# EAGLE design eLite Clock - Main - v2 (EAGLE 9.6.0)
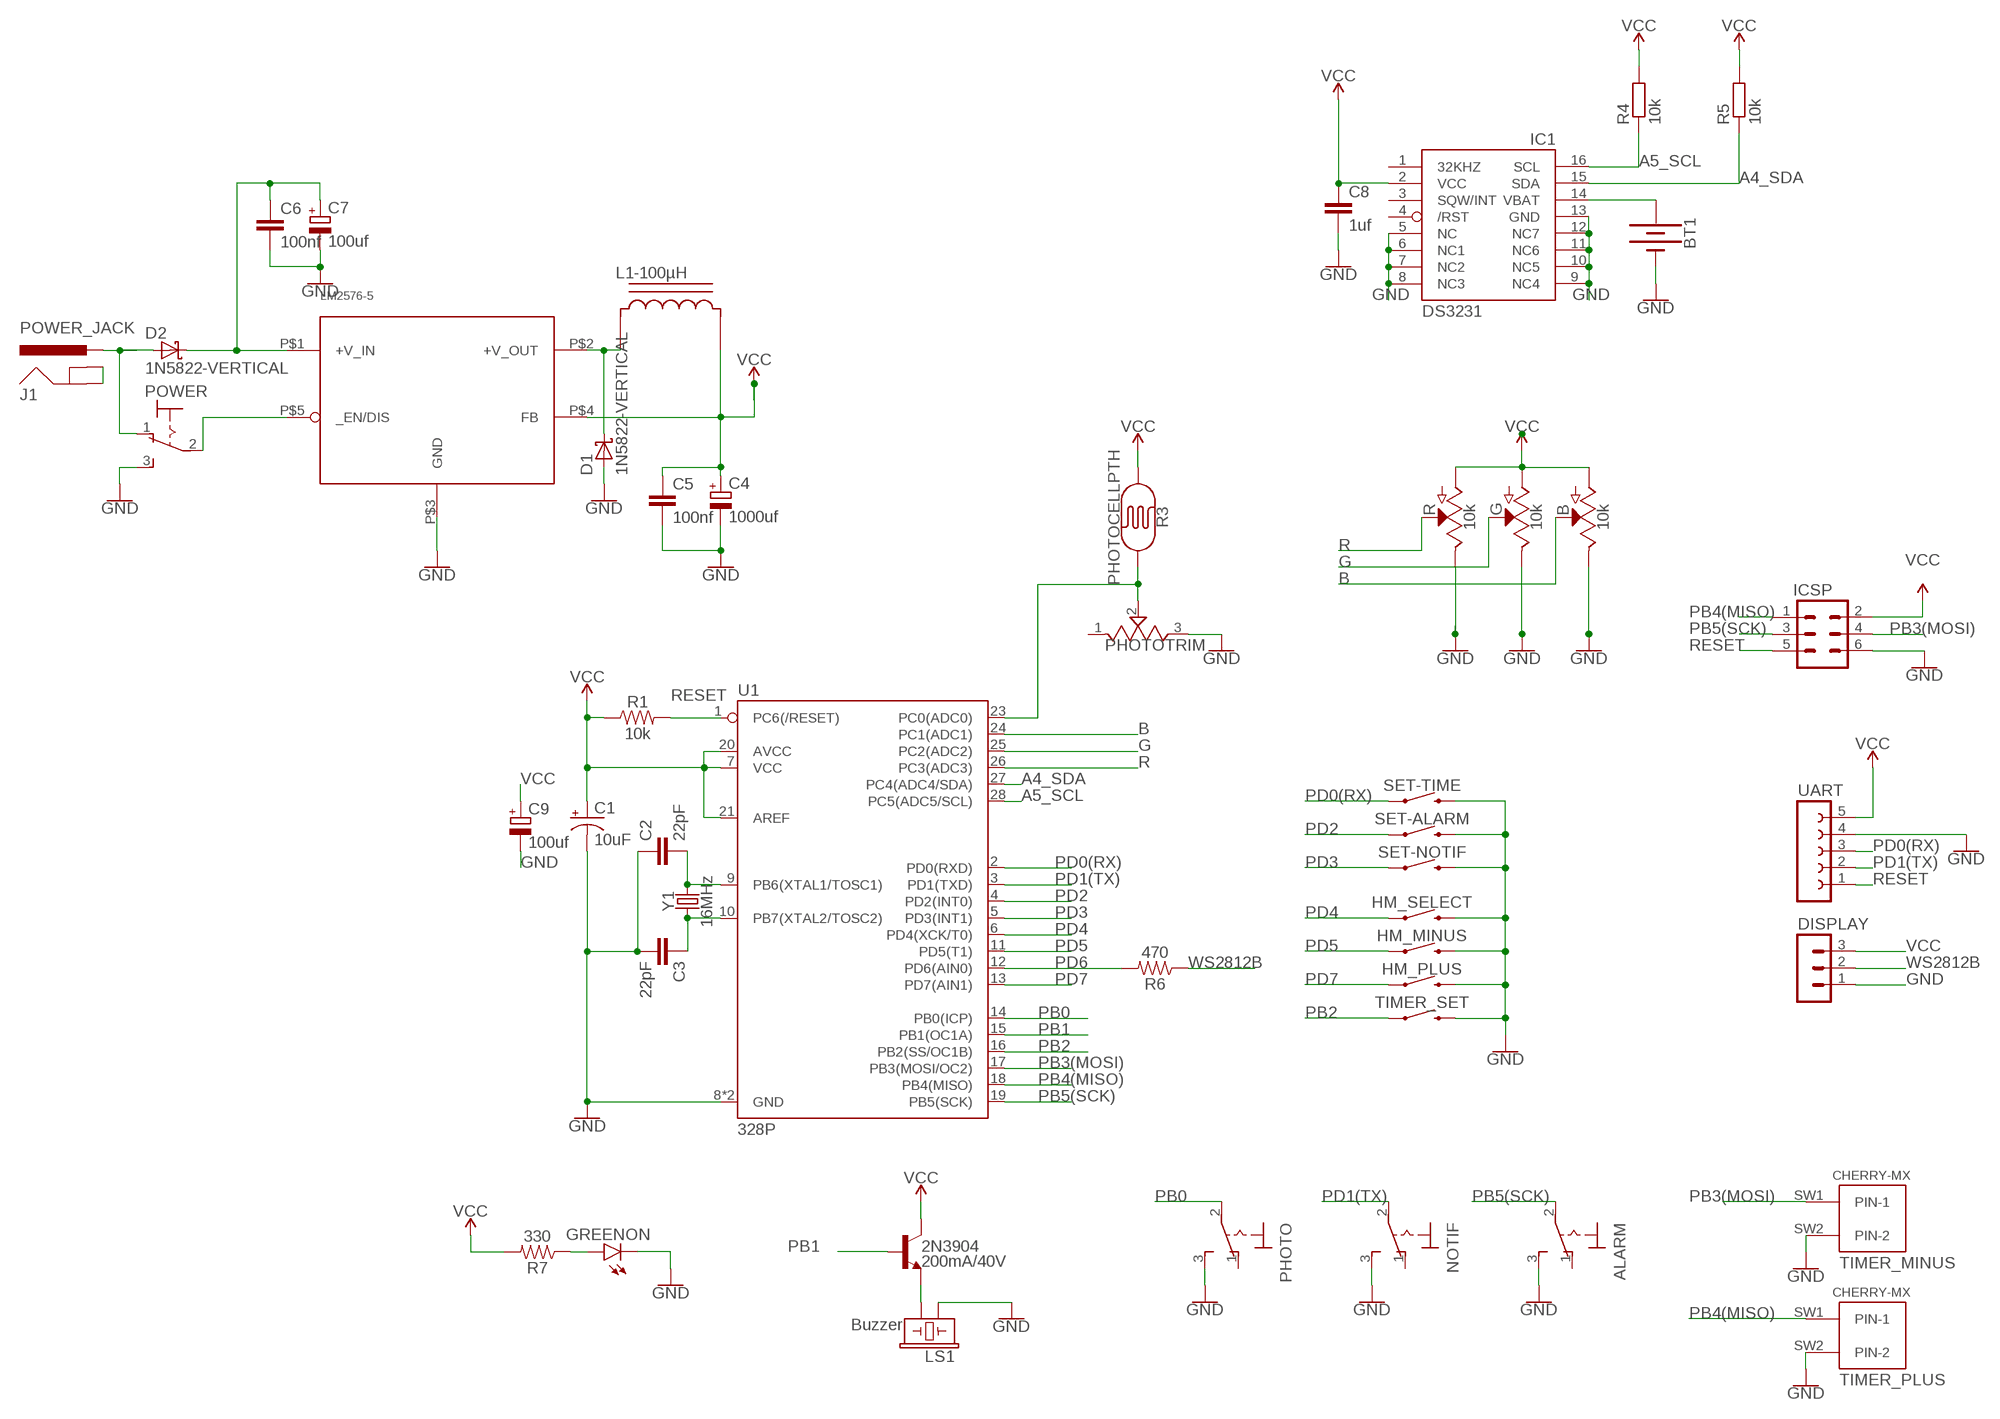
[diagram p0: schematic, sheet 1]

## Parts
2N3904  200mA/40V  TRANS_NPN-2N3904  [TO-92]
ALARM  320-916  [320-916]
B  10k  POT  [SINGLE_GANK_POTENTIOMETER]
BT1  BATTERY-20MM_PTH  [BATTCOM_20MM_PTH]
C1  10uF  10UF-POLAR-RADIAL-2.5MM-25V-20%  [CPOL-RADIAL-2.5MM-5MM]
C2  22pF  22PF-PTH-2.54MM-200V-5%  [CAP-PTH-2.54]
C3  22pF  22PF-PTH-2.54MM-200V-5%  [CAP-PTH-2.54]
C4  1000uf  CPOL-EUE5-13  [E5-13]
C5  100nf  C-EU025-025X050  [C025-025X050]
C6  100nf  C-EU025-025X050  [C025-025X050]
C7  100uf  CPOL-EUE2.5-5  [E2,5-5]
C8  1uf  C-EU025-025X050  [C025-025X050]
C9  100uf  CPOL-EUE3.5-10  [E3,5-10]
D1  1N5822-VERTICAL  [DIODE-VERTICAL]
D2  1N5822-VERTICAL  [DIODE-VERTICAL]
DISPLAY  MA03-1  [MA03-1]
G  10k  POT  [SINGLE_GANK_POTENTIOMETER]
GREENON  LED5MM  [LED5MM]
HM_MINUS  MOMENTARY-SWITCH-SPST-PTH-6.0MM  [TACTILE_SWITCH_PTH_6.0MM]
HM_PLUS  MOMENTARY-SWITCH-SPST-PTH-6.0MM  [TACTILE_SWITCH_PTH_6.0MM]
HM_SELECT  MOMENTARY-SWITCH-SPST-PTH-6.0MM  [TACTILE_SWITCH_PTH_6.0MM]
IC1  DS3231/SO  [SO16W]
ICSP  MA03-2  [MA03-2]
J1  POWER_JACK  [POWER_JACK_PTH]
L1-100µH  T37_INDUCTOR  [T37_INDUCTOR]
LM2576-5  LM2576-T05A  [TO-220-5_IN-LINE]
LS1  Buzzer  BUZZER-PTH  [BUZZER-12MM]
NOTIF  320-916  [320-916]
PHOTO  320-916  [320-916]
PHOTOTRIM  3306F-1-203  [TRIM_3306F-1-203]
POWER  320-916  [320-916]
R  10k  POT  [SINGLE_GANK_POTENTIOMETER]
R1  10k  10KOHM-HORIZ-1/4W-1%  [AXIAL-0.3]
R3  PHOTOCELLPTH  [PHOTOCELL]
R4  10k  R-EU_0207/7  [0207/7]
R5  10k  R-EU_0207/7  [0207/7]
R6  470  10KOHM-HORIZ-1/4W-1%  [AXIAL-0.3]
R7  330  10KOHM-HORIZ-1/4W-1%  [AXIAL-0.3]
SET-ALARM  MOMENTARY-SWITCH-SPST-PTH-6.0MM  [TACTILE_SWITCH_PTH_6.0MM]
SET-NOTIF  MOMENTARY-SWITCH-SPST-PTH-6.0MM  [TACTILE_SWITCH_PTH_6.0MM]
SET-TIME  MOMENTARY-SWITCH-SPST-PTH-6.0MM  [TACTILE_SWITCH_PTH_6.0MM]
TIMER_MINUS  TIMER_PLUS  CHERRY-MX  [CHERRY-MX]
TIMER_PLUS  TIMER_MINUS  CHERRY-MX  [CHERRY-MX]
TIMER_SET  MOMENTARY-SWITCH-SPST-PTH-6.0MM  [TACTILE_SWITCH_PTH_6.0MM]
U1  328P  ATMEGA328P_PDIP  [DIP28]
UART  FE05-1  [FE05-1]
Y1  16MHz  CRYSTAL-16MHZPTH-HC49US  [HC49US]

## Nets
A4_SDA: IC1.15(SDA) R5.1 U1.27(PC4(ADC4/SDA))
A5_SCL: IC1.16(SCL) R4.1 U1.28(PC5(ADC5/SCL))
B: B.P$2 U1.24(PC1(ADC1))
G: G.P$2 U1.25(PC2(ADC2))
GND: ALARM.3(S) B.P$1 BT1.2(-) C1.2(-) C2.1 C3.2 C4.- C5.2 C6.2 C7.- C8.2 C9.- D1.ANODE(A) DISPLAY.1 G.P$1 GREENON.K(C) HM_MINUS.3 HM_PLUS.3 HM_SELECT.3 IC1.5(NC) IC1.6(NC1) IC1.7(NC2) IC1.8(NC3) IC1.9(NC4) IC1.10(NC5) IC1.11(NC6) IC1.12(NC7) IC1.13(GND) ICSP.6 LM2576-5.P$3(GND) LS1.+ NOTIF.3(S) PHOTO.3(S) PHOTOTRIM.3(CW) POWER.3(S) R.P$1 SET-ALARM.3 SET-NOTIF.3 SET-TIME.3 TIMER_MINUS.SW2(PIN-2) TIMER_PLUS.SW2(PIN-2) TIMER_SET.3 U1.8(GND) U1.22(GND) UART.4
N$1: J1.GND J1.GNDBREAK
N$2: C2.2 U1.9(PB6(XTAL1/TOSC1)) Y1.2
N$3: C3.1 U1.10(PB7(XTAL2/TOSC2)) Y1.1
N$4: GREENON.A R7.P$1
N$5: PHOTOTRIM.2(W) R3.2 U1.23(PC0(ADC0))
N$6: D2.ANODE(A) J1.PWR POWER.1(O)
N$7: LM2576-5.P$5(_EN/DIS) POWER.2(P)
N$14: 2N3904.1(E) LS1.-
N$18: D1.CATHODE(C) L1-100µH.CB LM2576-5.P$2(+V_OUT)
N$24: C6.1 C7.+ D2.CATHODE(C) LM2576-5.P$1(+V_IN)
N$26: BT1.1(+) IC1.14(VBAT)
PB0: PHOTO.2(P) U1.14(PB0(ICP))
PB1: 2N3904.2(B) U1.15(PB1(OC1A))
PB2: TIMER_SET.1 U1.16(PB2(SS/OC1B))
PB3(MOSI): ICSP.4 TIMER_MINUS.SW1(PIN-1) U1.17(PB3(MOSI/OC2))
PB4(MISO): ICSP.1 TIMER_PLUS.SW1(PIN-1) U1.18(PB4(MISO))
PB5(SCK): ALARM.2(P) ICSP.3 U1.19(PB5(SCK))
PD0(RX): SET-TIME.1 U1.2(PD0(RXD)) UART.3
PD1(TX): NOTIF.2(P) U1.3(PD1(TXD)) UART.2
PD2: SET-ALARM.1 U1.4(PD2(INT0))
PD3: SET-NOTIF.1 U1.5(PD3(INT1))
PD4: HM_SELECT.1 U1.6(PD4(XCK/T0))
PD5: HM_MINUS.1 U1.11(PD5(T1))
PD6: R6.P$2 U1.12(PD6(AIN0))
PD7: HM_PLUS.1 U1.13(PD7(AIN1))
R: R.P$2 U1.26(PC3(ADC3))
RESET: ICSP.5 R1.P$2 U1.1(PC6(/RESET)) UART.1
VCC: 2N3904.3(C) B.P$3 C1.1(+) C4.+ C5.1 C8.1 C9.+ DISPLAY.3 G.P$3 IC1.2(VCC) ICSP.2 L1-100µH.CA LM2576-5.P$4(FB) R1.P$1 R3.1 R4.2 R5.2 R7.P$2 R.P$3 U1.7(VCC) U1.20(AVCC) U1.21(AREF) UART.5
WS2812B: DISPLAY.2 R6.P$1
Unconnected: ALARM.1(O) IC1.1(32KHZ) IC1.3(SQW/INT) IC1.4(/RST) NOTIF.1(O) PHOTO.1(O) PHOTOTRIM.1(CCW)

## Library data of the parts
2N3904 = SparkFun-DiscreteSemi:TRANS_NPN: NPN transistor Current controlled devices typically used to amplify current or used as a switch. BC547 - COM-08928 <http://www.sparkfun.com/products/8928> (TO-92 45V 100mA) (1.Collector 2.Base 3.Emitter) 2N3904 - COM-00521 <http://www.sparkfun.com/products/521> (TO-92 40V 200mA) (1.Emitter 2.Base 3.Collector) P2N2222A - COM-12852 <http://www.sparkfun.com/products/12852> (TO-92 40V 600mA) (1.Collector 2.Base 3.Emitter); PROD_ID: TRANS-08447
ALARM NOTIF PHOTO POWER = switch:320-916: TOGGLE SWITCH distributor RS Components
B G R = SingleGankPotentiometer:POT
BT1 = SparkFun-Batteries:BATTERY: Battery - Single Cell A variety of battery chemistries, sizes, and footprints. Device List: 20MM_PTH - Coin Cell Battery Holder - 20mm (PTH) <https://www.sparkfun.com/products/783> 20MM_PTH_KIT- Coin Cell battery Holder - 20 mm (PTH) <http://www.sparkfun.com/products/783>kit version with special mask 6.8MM_PTH - Coin Cell Battery Holder - 6.8MM(SMD) <https://www.digikey.com/product-detail/en/seiko-instruments/MS621FE-FL11E/728-1057-ND/1889208?WT.srch=1&gclid=CNOQ5a6LzdQCFZS2wAodXCkE0g> 12MM_SMD - Coin Cell Battery Holder - 12mm (SMD) <https://www.sparkfun.com/products/10592> 12MM_PTH - Coin Cell Battery Holder - 12mm (PTH) <https://www.sparkfun.com/products/7948> 20MM_SMD - 20mm Coin Cell Battery Holder (SMD) (2 legs) Used on the Big Time Watch Kit <https://www.sparkfun.com/products/11734> 20MM_SMD_4LEGS - Coin Cell Battery Holder - 20mm (SMD) <https://www.sparkfun.com/products/11892> 20MM_SMD_4LEGS_OVERPASTE - Coin Cell Battery Holder - 20mm (SMD) <https://www.sparkfun.com/products/11892> (Over-paste on the legs) 24.5MM_PTH - Coin Cell Battery Holder - 24.5mm (PTH) <https://www.sparkfun.com/products/8863> 9V - 9V Battery Holder - PC Mount Used on the SparkFun SparkPunk Sound Kit <https://www.sparkfun.com/products/11177> and SparkFun SparkPunk Sequencer Kit <https://www.sparkfun.com/products/12707> 18650 - Battery Holder - 18650 (PTH) <https://www.sparkfun.com/products/13113> AA - Battery Holder - 1xAA (PTH) <https://www.sparkfun.com/products/7949> AAA - Battery Holder - 1xAAA (PTH) <https://www.sparkfun.com/products/12718> AA_KIT - Battery Holder - 1xAA (PTH) <https://www.sparkfun.com/products/7949> Special kit package - pads only have exposed copper on one side of the board. AAA_KIT - Battery Holder - 1xAAA (PTH) <https://www.sparkfun.com/products/12718> Special kit package - pads only have exposed copper on one side of the board.; PROD_ID: BATT-09031; SF_SKU: PRT-00783
C1 = SparkFun-Capacitors:10UF-POLAR: 10.0µF polarized capacitors A capacitor is a passive two-terminal electrical component used to store electrical energy temporarily in an electric field.; PROD_ID: CAP-08440
C2 C3 = SparkFun-Capacitors:22PF: 22pF ceramic capacitors A capacitor is a passive two-terminal electrical component used to store electrical energy temporarily in an electric field.; PROD_ID: CAP-09128
C4 C7 C9 = rcl:CPOL-EU: POLARIZED CAPACITOR, European symbol; SPICEPREFIX: C
C5 C6 C8 = rcl:C-EU: CAPACITOR, European symbol; SPICEPREFIX: C
D1 D2 = 1N5822:1N5822-VERTICAL
DISPLAY = con-lstb:MA03-1: PIN HEADER; OC_FARNELL: unknown; OC_NEWARK: unknown
GREENON = led:LED: LED OSRAM: - CHIPLED LG R971, LG N971, LY N971, LG Q971, LY Q971, LO R971, LY R971 LH N974, LH R974 LS Q976, LO Q976, LY Q976 LO Q996 - Hyper CHIPLED LW Q18S LB Q993, LB Q99A, LB R99A - SideLED LS A670, LO A670, LY A670, LG A670, LP A670 LB A673, LV A673, LT A673, LW A673 LH A674 LY A675 LS A676, LA A676, LO A676, LY A676, LW A676 LS A679, LY A679, LG A679 - Hyper Micro SIDELED® LS Y876, LA Y876, LO Y876, LY Y876 LT Y87S - SmartLED LW L88C, LW L88S LB L89C, LB L89S, LG L890 LS L89K, LO L89K, LY L89K LS L896, LA L896, LO L896, LY L896 - TOPLED LS T670, LO T670, LY T670, LG T670, LP T670 LSG T670, LSP T670, LSY T670, LOP T670, LYG T670 LG T671, LOG T671, LSG T671 LB T673, LV T673, LT T673, LW T673 LH T674 LS T676, LA T676, LO T676, LY T676, LB T676, LH T676, LSB T676, LW T676 LB T67C, LV T67C, LT T67C, LS T67K, LO T67K, LY T67K, LW E67C LS E67B, LA E67B, LO E67B, LY E67B, LB E67C, LV E67C, LT E67C LW T67C LS T679, LY T679, LG T679 LS T770, LO T770, LY T770, LG T770, LP T770 LB T773, LV T773, LT T773, LW T773 LH T774 LS E675, LA E675, LY E675, LS T675 LS T776, LA T776, LO T776, LY T776, LB T776 LHGB T686 LT T68C, LB T68C - Hyper Mini TOPLED® LB M676 - Mini TOPLED Santana® LG M470 LS M47K, LO M47K, LY M47K Source: http://www.osram.convergy.de LUXEON: - LUMILED® LXK2-PW12-R00, LXK2-PW12-S00, LXK2-PW14-U00, LXK2-PW14-V00 LXK2-PM12-R00, LXK2-PM12-S00, LXK2-PM14-U00 LXK2-PE12-Q00, LXK2-PE12-R00, LXK2-PE12-S00, LXK2-PE14-T00, LXK2-PE14-U00 LXK2-PB12-K00, LXK2-PB12-L00, LXK2-PB12-M00, LXK2-PB14-N00, LXK2-PB14-P00, LXK2-PB14-Q00 LXK2-PR12-L00, LXK2-PR12-M00, LXK2-PR14-Q00, LXK2-PR14-R00 LXK2-PD12-Q00, LXK2-PD12-R00, LXK2-PD12-S00 LXK2-PH12-R00, LXK2-PH12-S00 LXK2-PL12-P00, LXK2-PL12-Q00, LXK2-PL12-R00 Source: www.luxeon.com KINGBRIGHT: KA-3528ASYC Source: www.kingbright.com
HM_MINUS HM_PLUS HM_SELECT SET-ALARM SET-NOTIF SET-TIME TIMER_SET = SparkFun-Switches:MOMENTARY-SWITCH-SPST: Momentary Switch (Pushbutton) - SPST Normally-open (NO) SPST momentary switches (buttons, pushbuttons). Variants PTH-12MM - 12mm square, through-hole Momentary Pushbutton Switch - 12mm Square <https://www.sparkfun.com/products/9190> (COM-09190) PTH-6.0MM, PTH-6.0MM-KIT - 6.0mm square, through-hole Mini Pushbutton Switch <https://www.sparkfun.com/products/97> (COM-00097) KIT package intended for soldering kit's - only one side of pads' copper is exposed. PTH-RIGHT-ANGLE-KIT - Right-angle, through-hole Right Angle Tactile Button <https://www.sparkfun.com/products/10791> - Used on SparkFun BigTime Watch Kit <https://www.sparkfun.com/products/11734> SMD-12MM - 12mm square, surface-mount Tactile Button - SMD (12mm) <https://www.sparkfun.com/products/12993> (COM-12993) Used on SparkFun PicoBoard <https://www.sparkfun.com/products/11888> SMD-4.5MM - 4.5mm Square Trackball Switch Used on SparkFun Blackberry Trackballer Breakout <https://www.sparkfun.com/products/13169> SMD-4.6MMX2.8MM - 4.60mm x 2.80mm, surface mount Used on SparkFun SAMD21 Mini Breakout <https://www.sparkfun.com/products/13664> SMD-5.2MM, SMD-5.2-REDUNDANT - 5.2mm square, surface-mount Mini Pushbutton Switch - SMD <https://www.sparkfun.com/products/8720> (COM-08720) Used on Arduino Pro Mini <https://www.sparkfun.com/products/11114> REDUNDANT package connects both switch circuits together SMD-6.0X3.5MM - 6.0 x 3.5mm, surface mount Momentary Reset Switch SMD <https://www.sparkfun.com/products/8229> (COM-08229) SMD-6.2MM-TALL - 6.2mm square, surface mount Tactile Button - SMD (6mm) <https://www.sparkfun.com/products/12992> Used on SparkFun Digital Sandbox <https://www.sparkfun.com/products/12651> SMD-RIGHT-ANGLE - Right-angle, surface mount Used on SparkFun Block for Intel® Edison - Arduino <https://www.sparkfun.com/products/13036>; PROD_ID: SWCH-08441; SF_SKU: COM-00097
IC1 = adafruit:DS3231
ICSP = con-lstb:MA03-2: PIN HEADER; OC_FARNELL: unknown; OC_NEWARK: unknown
J1 = SparkFun-Connectors:POWER_JACK: Power Jack Connector This is the standard 5.5mm barrel jack for power. The PTH is the most common, proven, reliable, footprint. The Slot footprint only works if the mill layer is transmitted to the PCB fab house so be warned. Here are the connectors we sell at SparkFun: DC Barrel Power Jack/Connector <https://www.sparkfun.com/products/119> (PRT-00119) DC Barrel Power Jack/Connector (SMD) <https://www.sparkfun.com/products/12748> (PRT-12748) DC Barrel Jack Adapter - Breadboard Compatible <https://www.sparkfun.com/products/10811> (PRT-10811) It is used on this SparkFun product (and many, many others): SparkFun RedBoard - Programmed with Arduino <https://www.sparkfun.com/products/12757> (DEV-12757) Also, if you need a mating power supply or connector, please check these out: Wall Adapter Power Supply - 9VDC 650mA <https://www.sparkfun.com/products/298> (TOL-00298) DC Barrel Jack Adapter - Male <https://www.sparkfun.com/products/10287> (PRT-10287); PROD_ID: CONN-08197
L1-100µH = toroid:T37_INDUCTOR: Inductor wound on a T37 Toroid
LM2576-5 = LM2576:LM2576-T05A: LM2576/LM2576HV Series SIMPLE SWITCHER® 3A Step-Down Voltage Regulator IN-LINE PACKAGE; SPICEPREFIX: X
LS1 = SparkFun-Electromechanical:BUZZER: Buzzer Small round buzzers that operate around the audible 2kHz range. You can use these as speakers to create simple music or user interfaces. Variant Overview: PTH - Mini Speaker - PC Mount 12mm 2.048kHz <https://www.sparkfun.com/products/7950> PTH_KIT - Mini Speaker - PC Mount 12mm 2.048kHz <https://www.sparkfun.com/products/7950> KIT simplifies soldering by adding stop mask to one side of the pads. PTH_NO_SILK - Mini Speaker - PC Mount 12mm 2.048kHz <https://www.sparkfun.com/products/7950> No silkscreen indicator of buzzer outline. PTH_KIT_NO_SILK - Mini Speaker - PC Mount 12mm 2.048kHz <https://www.sparkfun.com/products/7950> KIT package w/o silkscreen SMD - Buzzer Audio Magnetic (CCV-084B16) SMD buzzer used on, e.g. the LilyPad Buzzer <https://www.sparkfun.com/products/8463> and RFID USB Reader <https://www.sparkfun.com/products/9963>. SMD_KIT - Buzzer Audio Magnetic (CCV-084B16) SMD Buzzer with elongated pins to make soldering easier. Used on the SparkFun Simon Says - Surface Mount Soldering Kit <https://www.sparkfun.com/products/10935>.; PROD_ID: COMP-08253; SF_SKU: COM-07950
PHOTOTRIM = 3306F-1-203:3306F-1-203: 2 kOhms 0.2W, 1/5W PC Pins Through Hole Trimmer Potentiometer Cermet 1 Turn Top Adjustment; ARROW_ELECTRONICS-PURCHASE-URL: https://snapeda.com/shop?store=Arrow+Electronics&id=1444258; AVAILABILITY: Unavailable; DESCRIPTION: 20 kOhms 0.2W, 1/5W PC Pins Through Hole Trimmer Potentiometer Cermet 1 Turn Top Adjustment; DIGIKEY-PURCHASE-URL: https://snapeda.com/shop?store=DigiKey&id=1444258; MF: Bourns; MOUSER-PURCHASE-URL: https://snapeda.com/shop?store=Mouser&id=1444258; MP: 3306F-1-203; PACKAGE: 6432 Bourns; PRICE: None
R1 = SparkFun-Resistors:10KOHM: 10kΩ resistor A resistor is a passive two-terminal electrical component that implements electrical resistance as a circuit element. Resistors act to reduce current flow, and, at the same time, act to lower voltage levels within circuits. - Wikipedia; PROD_ID: RES-12183
R3 = SparkFun-Sensors:PHOTOCELL: Photocell (Photodetector, Photo Resistor, CdS) This is a very small light sensor. A photocell changes (also called a photodetector, photo resistor, CdS or photoconductive cell) resistance depending on the amount of light it is exposed to. These little sensors make great ambient light triggers (when light in the room turns on, do something). Datasheet <http://cdn.sparkfun.com/datasheets/Sensors/LightImaging/SEN-09088.pdf> SparkFun Products Mini Photocell <https://www.sparkfun.com/products/9088> (SEN-09088); PROD_ID: COMP-09129; SF_ID: SEN-09088
R4 R5 = rcl:R-EU_: RESISTOR, European symbol; SPICEPREFIX: R
R6 R7 = SparkFun-Resistors:10KOHM: 10kΩ resistor A resistor is a passive two-terminal electrical component that implements electrical resistance as a circuit element. Resistors act to reduce current flow, and, at the same time, act to lower voltage levels within circuits. - Wikipedia; PROD_ID: RES-12183; VALUE: 10k
TIMER_MINUS TIMER_PLUS = cherrymx:CHERRY-MX: Cherry MX series keyswitch
U1 = SparkFun-IC-Microcontroller:ATMEGA328P_PDIP: Atmel 328P Through hole ATMEGA328P uC used in the Arduino 32kb flash, 1k EEPROM, 2k SRAM Datasheet <http://www.sparkfun.com/datasheets/Components/SMD/ATMega328.pdf> SparkFun Products Storefront component: AVR 28 Pin 20MHz 32K 6A/D - ATMega328P <https://www.sparkfun.com/products/9061> (COM-09061) SparkFun Simon Says - Through-Hole Soldering Kit <https://www.sparkfun.com/products/10547> (KIT-10547) SparkFun Learn to Solder - Simon Says <https://www.sparkfun.com/products/13708> (KIT-13708) SparkFun BigTime Watch Kit <https://www.sparkfun.com/products/11734> (KIT-11734) SparkFun ClockIt <https://www.sparkfun.com/products/10930> (KIT-10930) SparkFun Serial Enabled LCD Kit <https://www.sparkfun.com/products/10097> (LCD-10097) SparkFun Simon Tilts - Through Hole Soldering Kit <https://www.sparkfun.com/products/12634> (KIT-12634) SparkFun Frequency Counter Kit <https://www.sparkfun.com/products/10140> (KIT-10140) FabFM Radio Kit <https://www.sparkfun.com/products/11043> (KIT-11043) SparkFun Binary Blaster Kit <https://www.sparkfun.com/products/12037> (KIT-12037) SparkFun Metro-Gnome <https://www.sparkfun.com/products/9236> (KIT-09236) ATmega328 with Arduino Optiboot (Uno) <https://www.sparkfun.com/products/10524> (DEV-10524); PROD_ID: IC-09136
UART = con-lsta:FE05-1: FEMALE HEADER; OC_FARNELL: unknown; OC_NEWARK: unknown
Y1 = SparkFun-Clocks:CRYSTAL-16MHZ: 16MHz Crystal Digikey Example <http://www.digikey.com/product-search/en?keywords=535-9122-1-ND> Frequency: 16MHz Frequency Stability: ±50ppm Frequency Tolerance: ±20ppm Load Capacitance: 18pF SparkFun Products: Pro Micro -5V/16MHz <https://www.sparkfun.com/products/12640> SparkFun Serial Enabled LCD Kit <https://www.sparkfun.com/products/10097>; PROD_ID: XTAL-08181; SF_ID: COM-00536

## Board
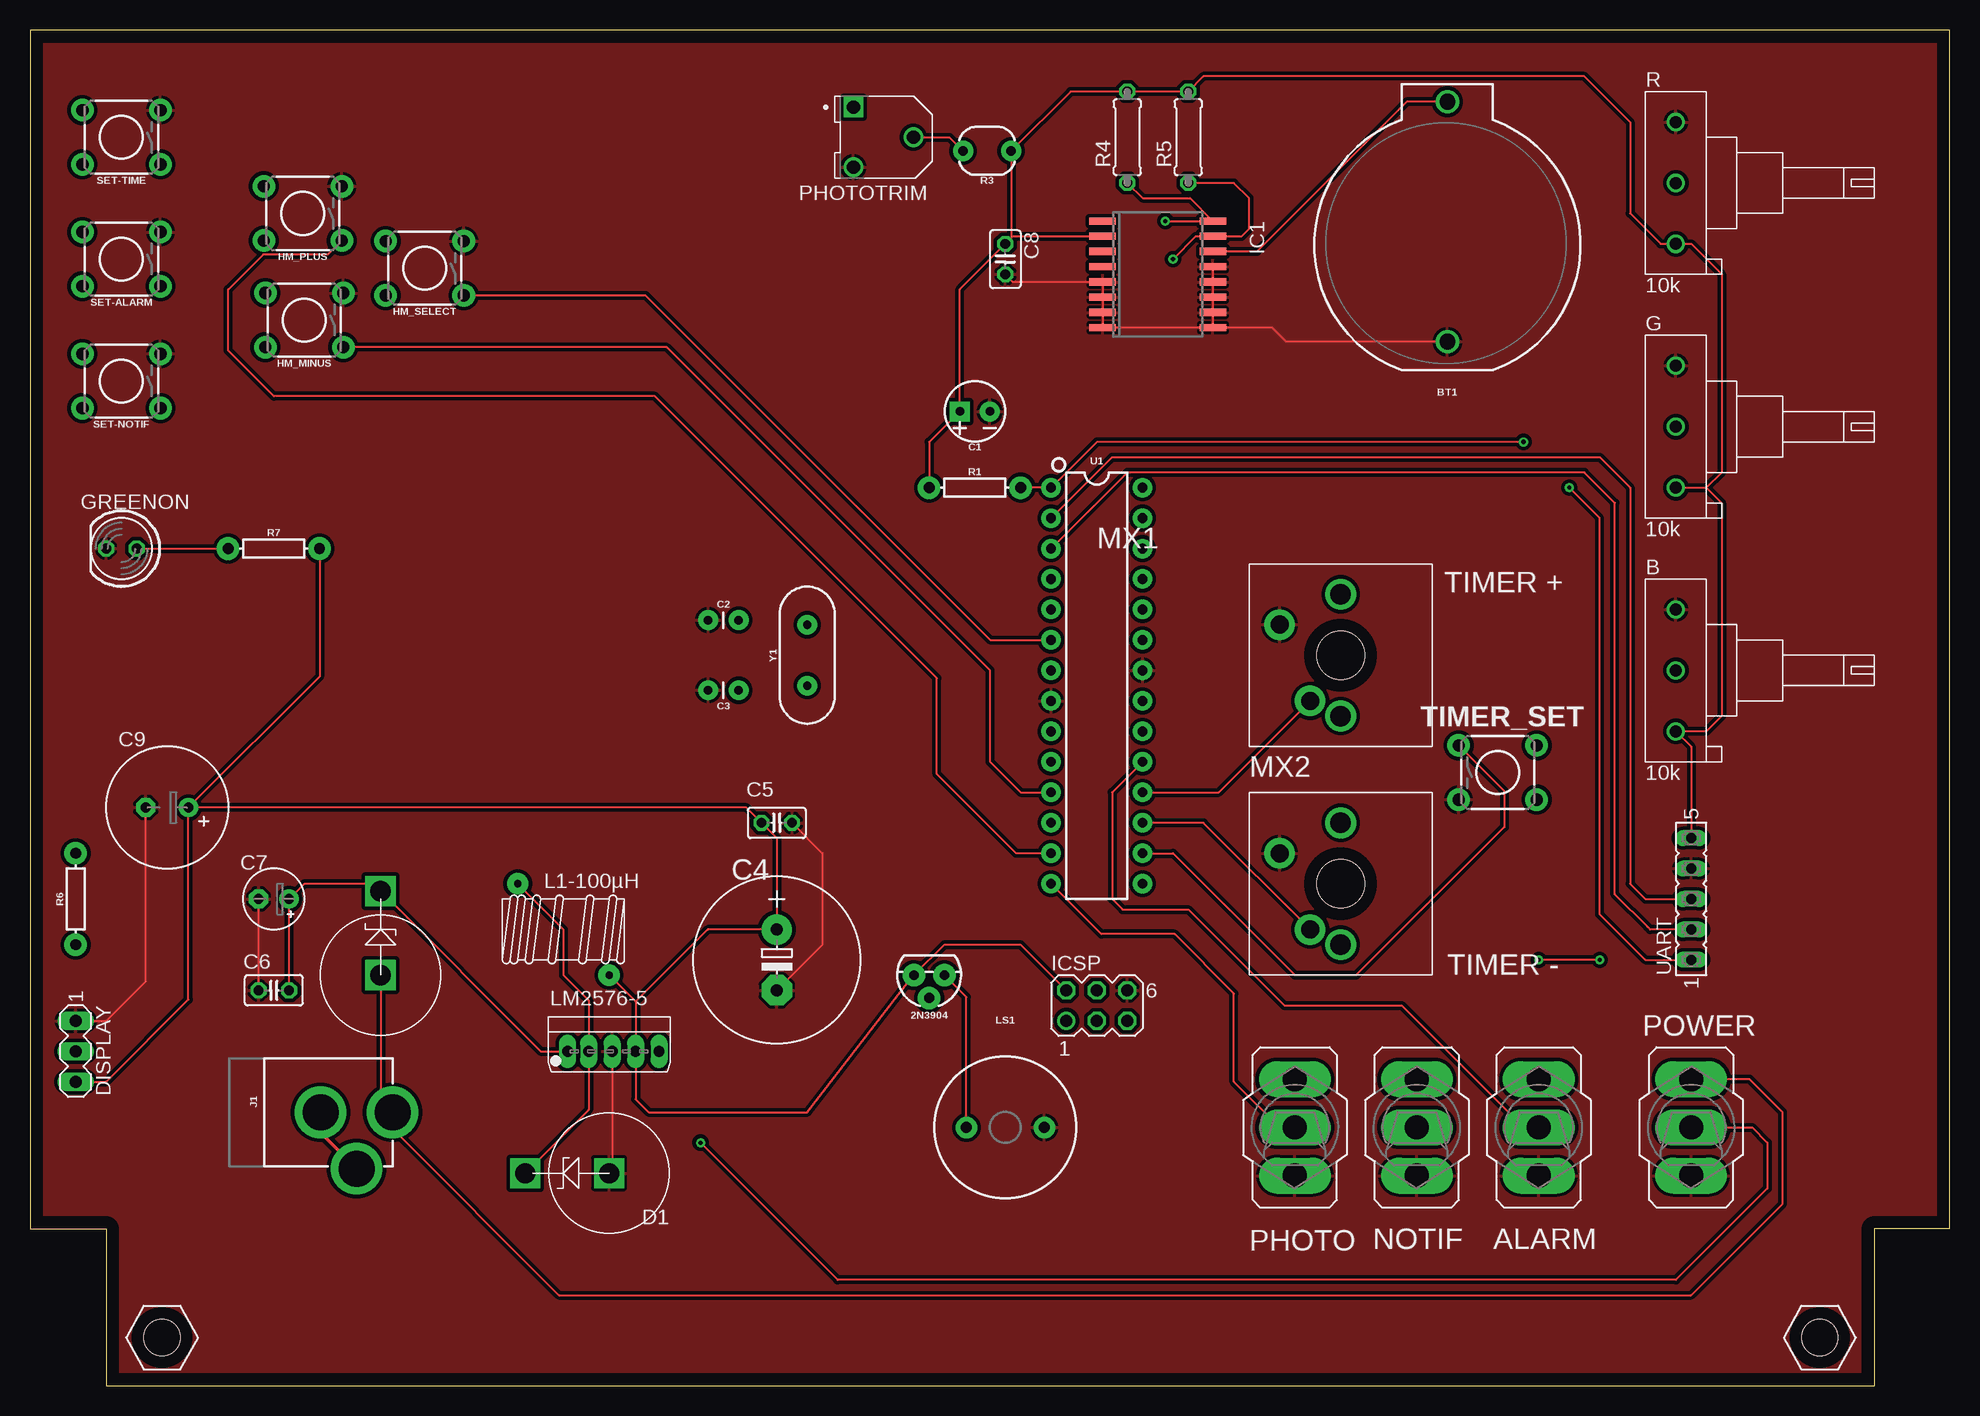
[diagram p1: board, top side]
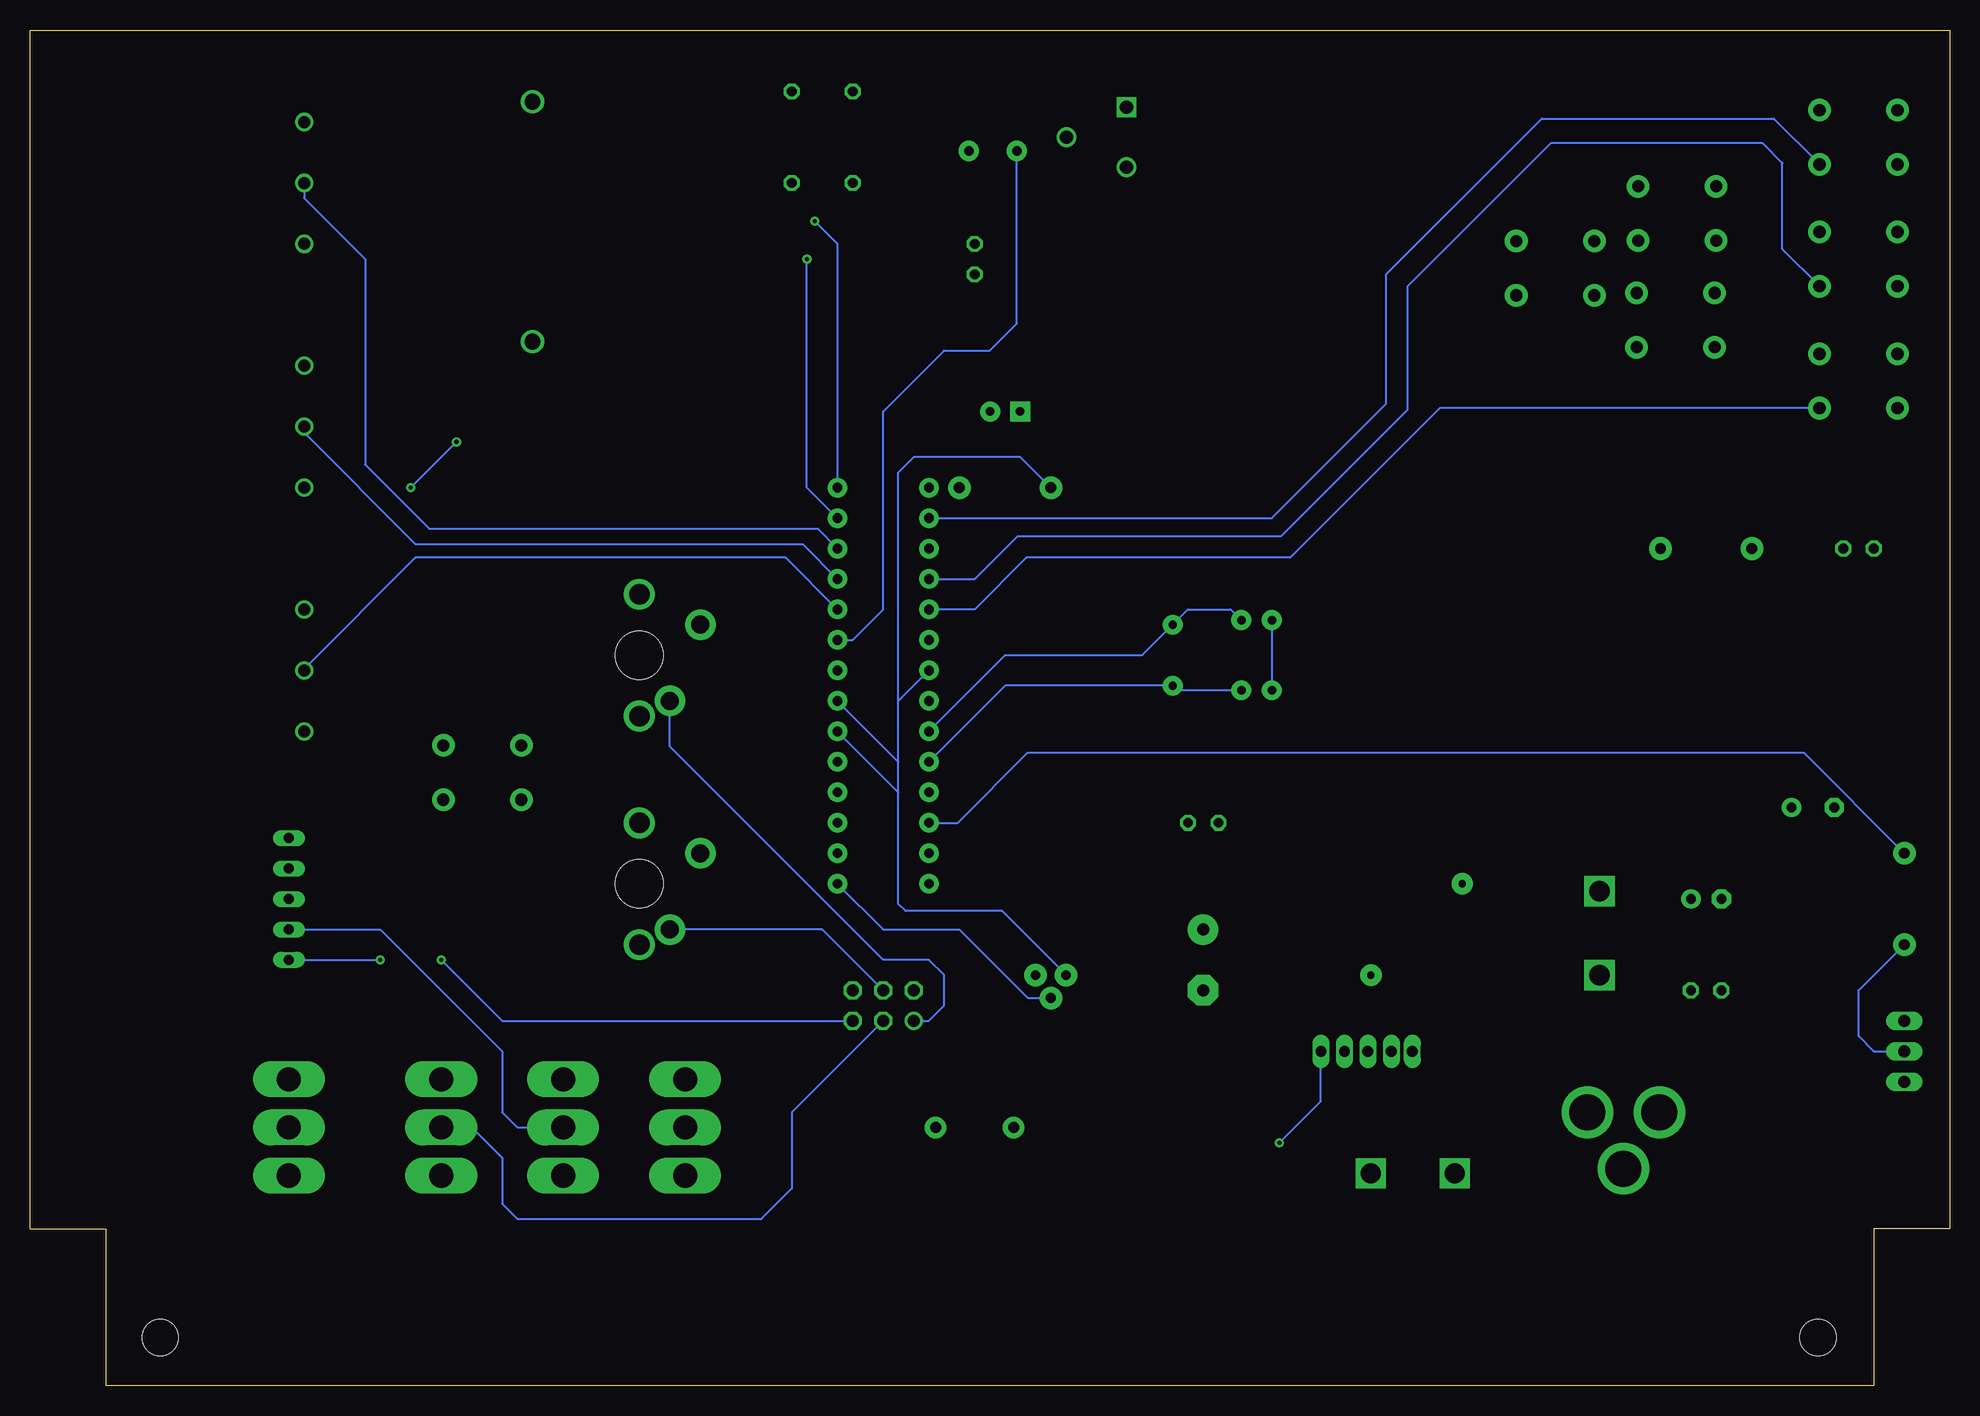
[diagram p2: board, bottom side, seen from below]

Size 160 x 113 mm. Coordinates in mm from the lower left corner, seen from the top.
Outline: 6.35,0 153.67,0 153.67,13.05 160,13.05 160,113 0,113 0,13.05 6.35,13.05 6.35,0
Copper layers (1*16): Top 0.035mm / dielectric 1.5mm / Bottom 0.035mm
Design rules "default": minimum track width 6mil, minimum drill 0.35mm, track to track 6mil, track to pad 6mil, pad to pad 6mil, via to via 6mil, smd to smd 6mil, copper to edge 40mil, drill to drill 6mil, minimum pad ring 10mil, minimum via ring 8mil, stop-mask expansion 4mil, vias tented up to drill 0mil, thermal gap 10mil
Holes 3 mm at 11,4 149.15,4

### Footprints (pad centres in the part's own frame; a part is rotated, then mirrored left to right if it is on the bottom)
TO-92 = drill 0.813 pad 1.88: 1 -1.27,0; 2 0,1.905; 3 1.27,0
320-916 = drill 2.007 long: 1 0,4.013; 2 0,0; 3 0,-4.013
SINGLE_GANK_POTENTIOMETER = drill 1: P$1 0,0; P$2 0,-5.08; P$3 0,-10.16
BATTCOM_20MM_PTH = drill 1.3: 1 11.85,0; 2 -8.15,0
CPOL-RADIAL-2.5MM-5MM = drill 0.7 pad 1.651 square: 1 1.25,0 | drill 0.7 pad 1.651: 2 -1.25,0
CAP-PTH-2.54 = drill 0.7 pad 1.651: 1 -1.27,0; 2 1.27,0
E5-13 = drill 1.016 pad 2.54: + -2.54,0 | drill 1.016 pad 2.54 octagon: - 2.54,0
C025-025X050 = drill 0.813 octagon: 1 -1.27,0; 2 1.27,0
E2,5-5 = drill 0.813 pad 1.6: + -1.27,0 | drill 0.813 pad 1.6 octagon: - 1.27,0
E3,5-10 = drill 0.813 pad 1.6: + -1.778,0 | drill 0.813 pad 1.6 octagon: - 1.778,0
DIODE-VERTICAL = drill 1.676 square: ANODE 0,0; CATHODE 7,0
MA03-1 = drill 1.016 long: 1 -2.54,0; 2 0,0; 3 2.54,0
LED5MM = drill 0.813 octagon: A -1.27,0; K 1.27,0
TACTILE_SWITCH_PTH_6.0MM = drill 1.016 pad 1.88: 1 -3.251,2.261; 2 3.251,2.261; 3 -3.251,-2.261; 4 3.251,-2.261
SO16W = smd 0.6 x 2.2: 1 -4.445,-4.6; 2 -3.175,-4.6; 3 -1.905,-4.6; 4 -0.635,-4.6; 5 0.635,-4.6; 6 1.905,-4.6; 7 3.175,-4.6; 8 4.445,-4.6; 9 4.445,4.6; 10 3.175,4.6; 11 1.905,4.6; 12 0.635,4.6; 13 -0.635,4.6; 14 -1.905,4.6; 15 -3.175,4.6; 16 -4.445,4.6
MA03-2 = drill 1.016: 1 -2.54,-1.27 | drill 1.016 octagon: 2 -2.54,1.27; 3 0,-1.27; 4 0,1.27; 5 2.54,-1.27; 6 2.54,1.27
POWER_JACK_PTH = drill 2.997 pad 4.318: GND 0,7.7; GNDBREAK 4.7,10.7; PWR 0,13.7
T37_INDUCTOR = drill 0.6 pad 1.778: CA -3.81,-3.81; CB 3.81,3.81
TO-220-5_IN-LINE = drill 0.889 pad 1.016 long: P$1 -3.454,0; P$2 -1.702,0; P$3 0.254,0; P$4 2.21,0; P$5 4.166,0
BUZZER-12MM = drill 0.9 pad 1.778: + 3.25,0; - -3.25,0
TRIM_3306F-1-203 = drill 1.1 square: 1 2.5,-2.5 | drill 1.1: 2 -2.5,0; 3 2.5,2.5
AXIAL-0.3 = drill 0.9 pad 1.88: P$1 -3.81,0; P$2 3.81,0
PHOTOCELL = drill 0.8 pad 1.676: 1 -2,0; 2 2,0
0207/7 = drill 0.813 octagon: 1 -3.81,0; 2 3.81,0
CHERRY-MX = drill 1.714 pad 1.93: P$3 -5.08,0; P$4 5.08,0 | drill 1.5 pad 2.54: SW1 -3.81,2.54; SW2 2.54,5.08 | hole 4: 0,0
DIP28 = drill 0.813 pad 1.626: 1 -16.51,-3.81; 2 -13.97,-3.81; 3 -11.43,-3.81; 4 -8.89,-3.81; 5 -6.35,-3.81; 6 -3.81,-3.81; 7 -1.27,-3.81; 8 1.27,-3.81; 9 3.81,-3.81; 10 6.35,-3.81; 11 8.89,-3.81; 12 11.43,-3.81; 13 13.97,-3.81; 14 16.51,-3.81; 15 16.51,3.81; 16 13.97,3.81; 17 11.43,3.81; 18 8.89,3.81; 19 6.35,3.81; 20 3.81,3.81; 21 1.27,3.81; 22 -1.27,3.81; 23 -3.81,3.81; 24 -6.35,3.81; 25 -8.89,3.81; 26 -11.43,3.81; 27 -13.97,3.81; 28 -16.51,3.81
FE05-1 = drill 0.813 long: 1 -5.08,0; 2 -2.54,0; 3 0,0; 4 2.54,0; 5 5.08,0
HC49US = drill 0.7 pad 1.651: 1 -2.54,0; 2 2.54,0

### Placement (x,y rotation side)
2N3904  74.93,34.21 180 top
ALARM  125.73,21.51 0 top
B  137.16,64.69 0 top
BT1  118.11,95.17 90 top
C1  78.74,81.2 180 top
C2  57.78,63.8 0 top
C3  57.78,57.96 180 top
C4  62.23,35.48 270 top
C5  62.23,46.91 0 top
C6  20.32,32.94 180 top
C7  20.32,40.56 180 top
C8  81.28,93.9 270 top
C9  11.43,48.18 180 top
D1  48.26,17.7 180 top
D2  29.21,34.21 90 top
DISPLAY  3.81,27.86 270 top
G  137.16,85.01 0 top
GREENON  7.62,69.77 180 top
HM_MINUS  22.86,88.82 180 top
HM_PLUS  22.73,97.71 180 top
HM_SELECT  32.89,93.14 180 top
IC1  93.98,92.63 270 top
ICSP  88.9,31.67 0 top
J1  16.51,22.78 270 top
L1-100µH  44.45,38.02 90 top
LM2576-5  48.26,27.86 0 top
LS1  81.28,21.51 0 top
NOTIF  115.57,21.51 0 top
PHOTO  105.41,21.51 0 top
PHOTOTRIM  71.12,104.06 180 top
POWER  138.43,21.51 0 top
R  137.16,105.33 0 top
R1  78.74,74.85 0 top
R3  79.76,102.92 180 top
R4  91.44,104.06 90 top
R5  96.52,104.06 90 top
R6  3.81,40.56 90 top
R7  20.32,69.77 0 top
SET-ALARM  7.62,93.9 180 top
SET-NOTIF  7.62,83.74 180 top
SET-TIME  7.62,104.06 180 top
TIMER_MINUS  109.22,41.83 90 top
TIMER_PLUS  109.22,60.88 90 top
TIMER_SET  122.3,51.1 0 top
U1  88.9,58.34 270 top
UART  138.43,40.56 90 top
Y1  64.77,60.88 90 top

### Tracks (layer width: path | path; a pad name or v marks a point on that pad's centre or on a via)
A4_SDA  (via drill 0.35)
  Top 0.152: R5.1 100.33,100.25 101.6,98.98 101.6,96.44 100.97,95.8 IC1.15 97.16,95.8 v95.25,93.9
  Bottom 0.152: U1.27 95.25,74.85 v95.25,93.9
A5_SCL  (via drill 0.35)
  Top 0.152: R4.1 92.71,98.98 96.67,98.98 IC1.16 v94.61,97.07
  Bottom 0.152: U1.28 92.71,95.17 v94.61,97.07
B
  Bottom 0.152: U1.24 97.03,69.01 127.89,69.01 137.16,59.74 B.P$2
G
  Bottom 0.152: G.P$2 137.16,79.42 127.88,70.14 95.62,70.14 U1.25
GND
  Top 0.152: C8.2 81.92,91.99 IC1.5 IC1.8 IC1.9 | BT1.2 104.67,87.02 103.5,88.18 IC1.9 | IC1.13 IC1.9 | C6.2 C7.- | LM2576-5.P$3 48.51,17.95 D1.ANODE | C5.2 66.04,44.37 66.04,36.75 C4.- | C9.- 9.65,33.7 6.35,30.4 DISPLAY.1
  Bottom 0.152: C2.1 C3.2
  pour Top (isolate 0.305): 0,0 0,112.95 160.02,112.95 160.02,0
N$1
  Top 0.305: J1.GND 24.21,21.08 J1.GNDBREAK
N$2
  Bottom 0.152: U1.9 78.74,60.88 67.31,60.88 Y1.2 63.5,64.69 59.94,64.69 C2.2
N$3
  Bottom 0.152: U1.10 78.74,58.34 Y1.1 64.39,57.96 C3.1
N$4
  Top 0.152: GREENON.A R7.P$1
N$5
  Top 0.152: PHOTOTRIM.2 76.61,104.06 R3.2
  Bottom 0.152: U1.23 91.44,62.15 88.9,64.69 88.9,81.2 83.82,86.28 80.01,86.28 77.76,88.53 R3.2
N$6
  Top 0.152: POWER.1 143.31,25.52 146.05,22.78 146.05,15.16 138.43,7.54 44.07,7.54 30.21,21.4 J1.PWR 29.21,23.78 D2.ANODE
N$7  (via drill 0.35)
  Top 0.152: POWER.2 143.51,21.51 144.78,20.24 144.78,16.43 137.16,8.81 67.31,8.81 v55.88,20.24
  Bottom 0.152: v55.88,20.24 52.43,23.69 LM2576-5.P$5
N$14
  Top 0.152: LS1.- 78.03,32.38 2N3904.1
N$18
  Top 0.152: D1.CATHODE 46.56,23 LM2576-5.P$2 46.56,32.1 44.45,34.21 44.45,38.02 L1-100µH.CB
N$24
  Top 0.152: C6.1 C7.+ 22.86,41.83 28.59,41.83 D2.CATHODE 42.56,27.86 LM2576-5.P$1
N$26
  Top 0.152: BT1.1 114.72,107.02 102.23,94.53 IC1.14
PB0
  Top 0.152: PHOTO.2 104.14,21.51 100.33,25.32 100.33,32.69 95.38,37.64 89.28,37.64 U1.14
PB1
  Bottom 0.152: U1.15 88.9,38.02 82.55,38.02 76.83,32.3 2N3904.2
PB2
  Top 0.152: U1.16 95.25,44.37 105.41,34.21 110.51,34.21 122.86,46.56 122.86,49.55 TIMER_SET.1
PB3(MOSI)
  Top 0.152: TIMER_MINUS.SW1 97.79,46.91 U1.17
  Bottom 0.152: ICSP.4 93.98,38.02 TIMER_MINUS.SW1
PB4(MISO)
  Top 0.152: TIMER_PLUS.SW1 99.06,49.45 U1.18
  Bottom 0.152: ICSP.1 85.09,30.4 83.82,31.67 83.82,34.21 85.09,35.48 88.9,35.48 106.68,53.26 TIMER_PLUS.SW1
PB5(SCK)
  Top 0.152: U1.19 90.17,49.45 90.17,40.56 91.06,39.67 96.52,39.67 104.52,31.67 114.3,31.67 124.46,21.51 ALARM.2
  Bottom 0.152: ICSP.3 96.52,22.78 96.52,16.43 99.06,13.89 119.38,13.89 120.65,15.16 120.65,18.97 123.19,21.51 ALARM.2
PD0(RX)
  Top 0.152: U1.2 90.17,77.39 130.81,77.39 133.35,74.85 133.35,41.83 134.62,40.56 UART.3
  Bottom 0.152: SET-TIME.1 14.68,105.61 34.01,105.61 46.99,92.63 46.99,81.83 56.52,72.31 U1.2
PD1(TX)
  Top 0.152: U1.3 91.44,76.12 129.54,76.12 132.08,73.58 132.08,40.94 134.81,38.21 135,38.02 UART.2
  Bottom 0.152: NOTIF.2 119.38,21.51 120.65,22.78 120.65,27.86 130.81,38.02 UART.2
PD2
  Bottom 0.152: U1.4 81.28,67.23 77.72,70.79 55.75,70.79 45.21,81.33 45.21,91.61 33.27,103.55 15.62,103.55 13.97,101.9 13.97,94.74 SET-ALARM.1
PD3
  Bottom 0.152: SET-NOTIF.1 42.52,81.48 54.99,69.01 76.96,69.01 81.28,64.69 U1.5
PD4
  Top 0.152: HM_SELECT.1 51.28,90.88 80.01,62.15 U1.6
PD5
  Top 0.152: HM_MINUS.1 53.06,86.56 80.01,59.61 80.01,51.99 82.55,49.45 U1.11
PD6
  Bottom 0.152: R6.P$2 12.19,52.75 76.83,52.75 82.68,46.91 U1.12
PD7
  Top 0.152: HM_PLUS.1 24.82,94.28 19.43,94.28 16.51,91.36 16.51,86.28 20.32,82.47 52.07,82.47 75.56,58.97 75.56,50.97 82.17,44.37 U1.13
R
  Bottom 0.152: R.P$2 137.16,98.98 132.08,93.9 132.08,76.75 126.75,71.42 94.36,71.42 U1.26
RESET  (via drill 0.35)
  Top 0.152: R1.P$2 U1.1 88.9,78.66 v124.46,78.66 | UART.1 134.62,35.48 130.81,39.29 130.81,72.31 v128.27,74.85 | v130.81,35.48 v125.73,35.48
  Bottom 0.152: v128.27,74.85 v124.46,78.66 | UART.1 v130.81,35.48 | v125.73,35.48 120.65,30.4 ICSP.5
VCC
  Top 0.152: C8.1 81.92,95.8 IC1.2 | 139.7,74.85 140.97,76.12 140.97,92.63 138.43,95.17 R.P$3 135.89,95.17 133.35,97.71 133.35,105.33 129.54,109.14 97.79,109.14 R5.2 R4.2 86.71,107.87 R3.1 81.76,95.65 C8.1 | G.P$3 139.7,74.85 | 139.7,74.85 140.97,73.58 140.97,55.8 139.7,54.53 B.P$3 138.43,53.26 UART.5 | R1.P$1 74.93,78.66 74.95,78.66 C1.1 77.49,91.38 C8.1 | DISPLAY.3 6.35,25.32 13.21,32.18 C9.+ | L1-100µH.CA 50.47,32 | 50.47,32 LM2576-5.P$4 50.47,23.87 51.56,22.78 64.77,22.78 2N3904.3 76.2,36.75 82.55,36.75 ICSP.2 | 50.47,32 56.49,38.02 C4.+ 62.23,45.64 C5.1 59.69,48.18 C9.+ | R7.P$2 24.13,59.1 C9.+
  Bottom 0.152: R1.P$1 77.47,77.39 86.36,77.39 87.63,76.12 87.63,57.07 | 87.63,49.45 87.63,40.14 87.04,39.54 78.99,39.54 2N3904.3 | 87.63,49.45 87.63,51.99 | U1.21 87.63,51.99 | U1.7 87.63,57.07 | U1.20 87.63,49.45 | 87.63,51.99 87.63,57.07
WS2812B
  Bottom 0.152: R6.P$1 7.62,32.94 7.62,29.13 6.35,27.86 DISPLAY.2

### Text on the board
tNames: MX1 | TIMER + | MX2 | TIMER -